# EAGLE design B311D (EAGLE 6.6.0)
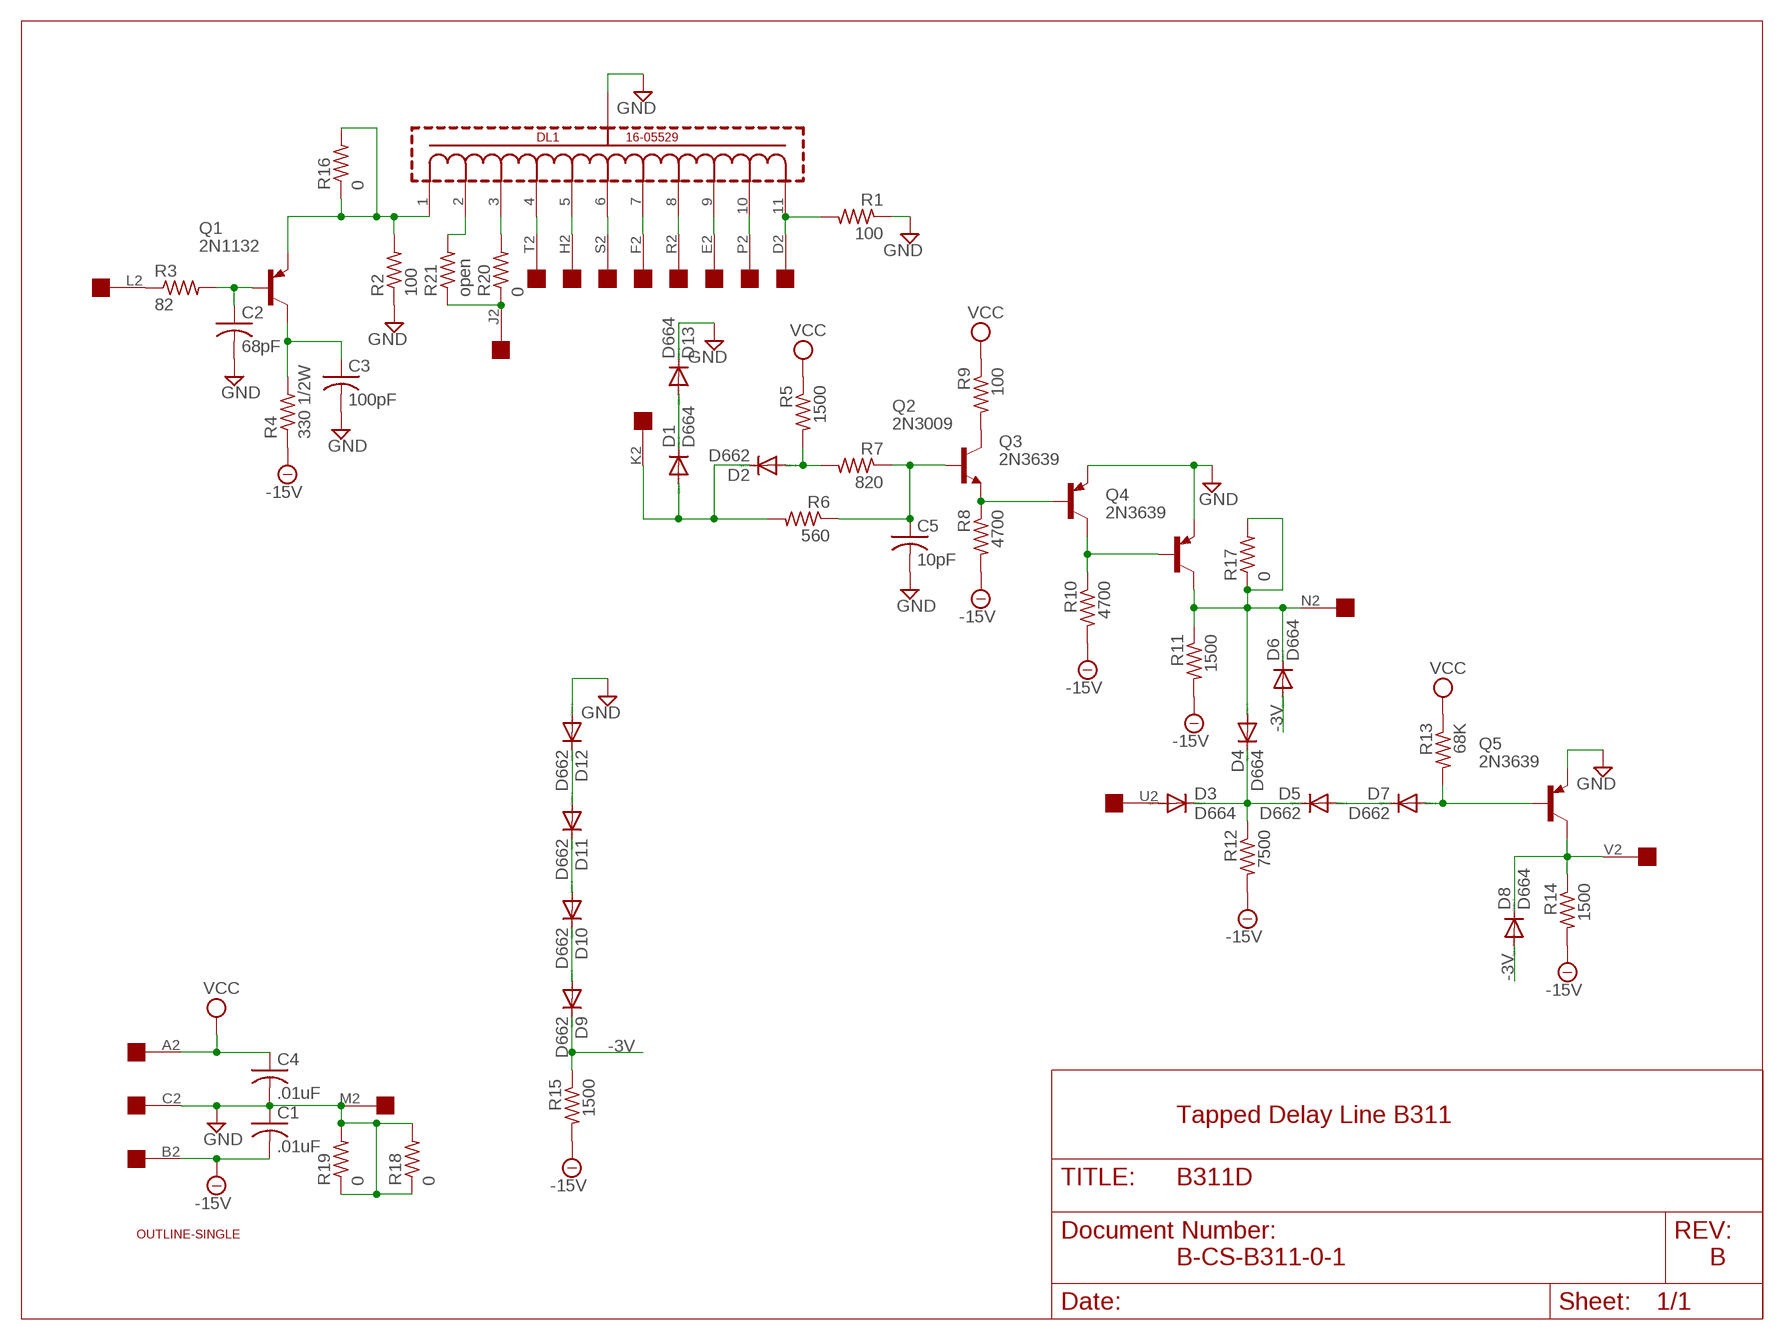
[diagram p0: schematic, sheet 1]

## Parts
C1  .01uF  C-US  [C063-025X075]
C2  68pF  C-US  [C063-025X075]
C3  100pF  C-US  [C063-025X075]
C4  .01uF  C-US  [C063-025X075]
C5  10pF  C-US  [C063-025X075]
D1  D664  DIODE-DO35-10  [DO35-10]
D2  D662  DIODE-DO35-10  [DO35-10]
D3  D664  DIODE-DO35-10  [DO35-10]
D4  D664  DIODE-DO35-10  [DO35-10]
D5  D662  DIODE-DO35-10  [DO35-10]
D6  D664  DIODE-DO35-10  [DO35-10]
D7  D662  DIODE-DO35-10  [DO35-10]
D8  D664  DIODE-DO35-10  [DO35-10]
D9  D662  DIODE-DO35-10  [DO35-10]
D10  D662  DIODE-DO35-10  [DO35-10]
D11  D662  DIODE-DO35-10  [DO35-10]
D12  D662  DIODE-DO35-10  [DO35-10]
D13  D664  DIODE-DO35-10  [DO35-10]
DL1  16-05529  [16-05529]
Q1  2N1132  -PNP-TO5  [TO5]
Q2  2N3009  -NPN-TO5  [TO5]
Q3  2N3639  -PNP-TO5  [TO5]
Q4  2N3639  -PNP-TO5  [TO5]
Q5  2N3639  -PNP-TO5  [TO5]
R1  100  R-US_0207/10  [0207/10]
R2  100  R-US_0207/10  [0207/10]
R3  82  R-US_0207/10  [0207/10]
R4  330 1/2W  R-US_0411/15  [0411/15]
R5  1500  R-US_0207/10  [0207/10]
R6  560  R-US_0207/10  [0207/10]
R7  820  R-US_0207/10  [0207/10]
R8  4700  R-US_0207/10  [0207/10]
R9  100  R-US_0207/10  [0207/10]
R10  4700  R-US_0207/10  [0207/10]
R11  1500  R-US_0207/10  [0207/10]
R12  7500  R-US_0207/10  [0207/10]
R13  68K  R-US_0207/10  [0207/10]
R14  1500  R-US_0207/10  [0207/10]
R15  1500  R-US_0207/10  [0207/10]
R16  0  R-US_0207/10  [0207/10]
R17  0  R-US_0207/10  [0207/10]
R18  0  R-US_0207/10  [0207/10]
R19  0  R-US_0207/10  [0207/10]
R20  0  R-US_0207/10  [0207/10]
R21  open  R-US_0207/10  [0207/10]
U$1  OUTLINE-SINGLE  [SINGLE]
U$2  EDGE-1  [EDGE-CON1]

## Nets
-3V: D6.A D8.A D9.C R15.1
-15V: C1.2 R4.1 R8.2 R10.2 R11.2 R12.2 R14.2 R15.2 U$2.B2
GND: C1.1 C2.2 C3.2 C4.2 C5.2 D12.A D13.C DL1.12(GND) Q3.1(E) Q4.1(E) Q5.1(E) R1.1 R2.1 R18.1 R18.2 R19.1 R19.2 U$2.C2 U$2.M2
N$1: DL1.11 R1.2 U$2.D2
N$2: DL1.10 U$2.P2
N$3: DL1.9 U$2.E2
N$4: DL1.8 U$2.R2
N$5: DL1.3 R20.2
N$6: DL1.4 U$2.T2
N$7: DL1.5 U$2.H2
N$8: DL1.6 U$2.S2
N$9: DL1.7 U$2.F2
N$10: R20.1 R21.1 U$2.J2
N$11: DL1.2 R21.2
N$12: DL1.1 Q1.1(E) R2.2 R16.1 R16.2
N$13: C2.1 Q1.2(B) R3.2
N$14: R3.1 U$2.L2
N$15: C3.1 Q1.3(C) R4.2
N$16: D1.A D2.C R6.2 U$2.K2
N$17: D1.C D13.A
N$18: D2.A R5.2 R7.2
N$19: C5.1 Q2.2(B) R6.1 R7.1
N$20: Q2.3(C) R9.2
N$21: Q2.1(E) Q3.2(B) R8.1
N$22: Q3.3(C) Q4.2(B) R10.1
N$23: D4.A D6.C Q4.3(C) R11.1 R17.1 R17.2 U$2.N2
N$24: D11.A D12.C
N$25: D9.A D10.C
N$26: D10.A D11.C
N$27: D3.A U$2.U2
N$28: D3.C D4.C D5.C R12.1
N$29: D5.A D7.C
N$30: D7.A Q5.2(B) R13.2
N$31: D8.C Q5.3(C) R14.1 U$2.V2
VCC: C4.1 R5.1 R9.1 R13.1 U$2.A2

## Notes on the sheet
- Tapped Delay Line B311
- B-CS-B311-0-1 | B

## Library data of the parts
C1-C5 = dec-con:C-US: Capacitors with funky DEC lead spacing.
D1-D13 = diode:DIODE-: DIODE
DL1 = dec-con:16-05529: Delay Line (M311 style)
Q1 Q3-Q5 = transistor:*-PNP-: PNP Transistror
Q2 = transistor:*-NPN-: NPN Transistror BF959 corrected 2008.03.06
R1-R21 = rcl:R-US_: RESISTOR, American symbol
U$1 = dec-con:OUTLINE-*: Board outlines for DEC boards.
U$2 = dec-con:EDGE-1: Single-Sided DEC Edge Connector -- (side 2)

## Net classes
0 default: width 0.813 mm

## Board
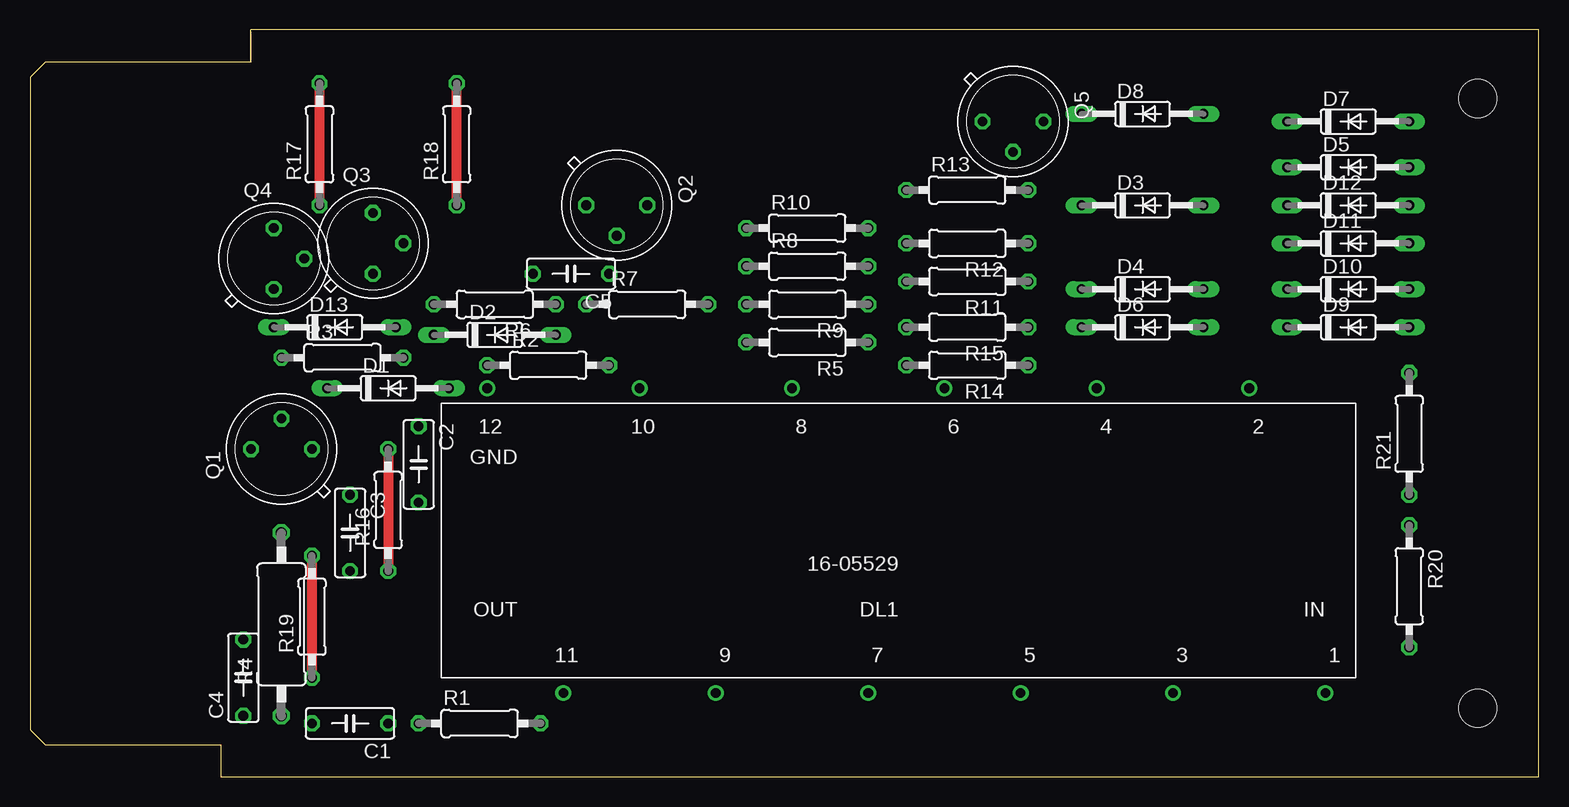
[diagram p1: board, top side]
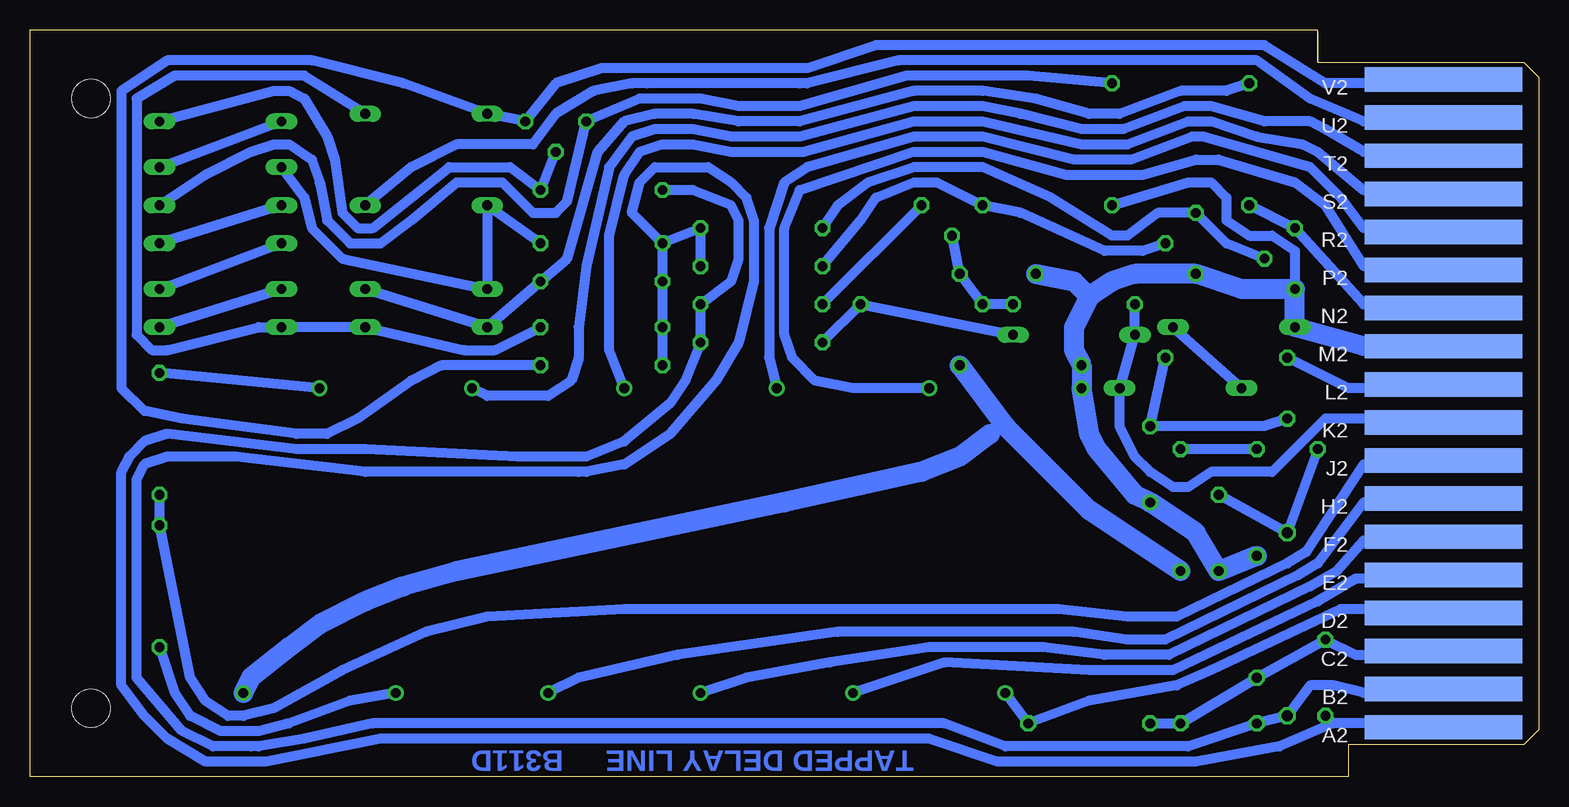
[diagram p2: board, bottom side, seen from below]

Size 125.73 x 62.23 mm. Coordinates in mm from the lower left corner, seen from the top.
Copper layers (1+16): Top 0.035mm / dielectric 1.5mm / Bottom 0.035mm
Design rules "16mils": minimum track width 16mil, minimum drill 32mil, track to track 15mil, track to pad 10mil, pad to pad 10mil, via to via 10mil, smd to smd 10mil, copper to edge 13mil, drill to drill 10mil, minimum pad ring 10mil, minimum via ring 8mil, stop-mask expansion 0mil, vias tented up to drill 0mil, thermal gap 10mil

### Footprints (pad centres in the part's own frame; a part is rotated, then mirrored left to right if it is on the bottom)
C063-025X075 = drill 0.813 octagon: 1 -2.54,0; 2 3.81,0
DO35-10 = drill 0.813 long: A 5.08,0; C -5.08,0
16-05529 = drill 0.813: 1 -35.56,12.7; 2 -29.21,-12.7; 3 -22.86,12.7; 4 -16.51,-12.7; 5 -10.16,12.7; 6 -3.81,-12.7; 7 2.54,12.7; 8 8.89,-12.7; 9 15.24,12.7; 10 21.59,-12.7; 11 27.94,12.7; 12 34.29,-12.7
TO5 = drill 0.813 octagon: 1 0,-2.54; 2 2.54,0; 3 0,2.54
0207/10 = drill 0.813 octagon: 1 -5.08,0; 2 5.08,0
0411/15 = drill 0.914 octagon: 1 -7.62,0; 2 7.62,0
SINGLE = hole 3.175: 120.65,56.515; 120.65,5.715
EDGE-CON1 = smd 13.106 x 2.032 bottom: A2 7.938,4.128; B2 7.938,7.303; C2 7.938,10.477; D2 7.938,13.652; E2 7.938,16.828; F2 7.938,20.003; H2 7.938,23.177; J2 7.938,26.352; K2 7.938,29.527; L2 7.938,32.703; M2 7.938,35.877; N2 7.938,39.053; P2 7.938,42.227; R2 7.938,45.403; S2 7.938,48.578; T2 7.938,51.752; U2 7.938,54.928; V2 7.938,58.102

### Placement (x,y rotation side)
C1  27.31,4.45 180 top
C2  32.39,26.67 270 top
C3  26.67,20.95 270 top
C4  17.78,7.62 90 top
C5  45.72,41.91 180 top
D1  29.85,32.38 0 top
D2  38.74,36.83 0 top
D3  92.71,47.62 0 top
D4  92.71,40.64 0 top
D5  109.86,50.8 0 top
D6  92.71,37.47 0 top
D7  109.86,54.61 0 top
D8  92.71,55.24 0 top
D9  109.86,37.47 0 top
D10  109.86,40.64 0 top
D11  109.86,44.45 0 top
D12  109.86,47.62 0 top
D13  25.4,37.47 0 top
DL1  72.39,19.68 180 top
Q1  20.96,27.3 90 top
Q2  48.9,47.62 270 top
Q3  28.58,44.45 0 top
Q4  20.32,43.18 0 top
Q5  81.92,54.61 270 top
R1  37.47,4.45 0 top
R2  43.18,34.29 0 top
R3  26.04,34.92 0 top
R4  20.96,12.7 90 top
R5  64.77,36.2 180 top
R6  38.74,39.37 180 top
R7  51.44,39.37 0 top
R8  64.77,42.55 0 top
R9  64.77,39.37 180 top
R10  64.77,45.72 0 top
R11  78.11,41.27 180 top
R12  78.11,44.45 180 top
R13  78.11,48.9 0 top
R14  78.11,34.29 180 top
R15  78.11,37.47 180 top
R16  29.85,22.23 90 top
R17  24.13,52.7 90 top
R18  35.56,52.7 90 top
R19  23.5,13.34 90 top
R20  114.94,15.88 270 top
R21  114.94,28.57 90 top
U$1  0,0 0 top
U$2  0,0 0 top

### Tracks (layer width: path | path; a pad name or v marks a point on that pad's centre or on a via)
-3V
  Bottom 0.813: D8.A 102.87,58.42 113.67,58.42 116.84,56.52 116.84,36.83 115.57,35.56 114.3,35.56 106.68,37.47 D9.C D6.A 89.54,35.56 87,35.56 R15.1
-15V
  Bottom 0.813: U$2.B2 8.89,6.99 14.61,6.99 17.15,7.62 19.05,7.62 R4.1 C1.2 29.21,2.54 44.45,2.54 49.53,4.45 97.16,4.45 102.87,3.17 106.68,2.54 107.32,2.54 110.49,2.54 113.03,3.81 116.84,8.26 116.84,24.77 116.21,26.04 114.3,26.67 108.59,26.67 97.79,25.4 80.01,25.4 79.38,25.4 76.2,26.04 72.39,28.57 68.58,33.02 66.68,36.2 65.41,41.27 65.41,46.35 66.04,48.26 67.31,49.53 69.22,50.8 73.66,50.8 74.93,49.53 75.57,46.99 R12.2 | R12.2 R11.2 R15.2 R14.2 | R8.2 R10.2 R12.2
GND
  Top 0.813: R19.2 R19.1 | R18.1 R18.2
  Bottom 0.813: R1.1 C1.1 R19.1 C4.2 15.24,10.16 8.89,10.16 U$2.C2 | U$2.M2 14.61,35.88 | D12.A 111.13,50.16 107.32,52.07 105.41,52.7 104.14,52.7 102.24,51.44 101.6,49.53 100.97,46.35 99.06,44.45 96.52,44.45 93.98,46.35 90.17,49.53 86.36,49.53 83.82,46.99 81.92,46.99 80.96,47.94 Q5.1 74.93,56.52 69.85,56.52 66.68,55.88 61.6,55.88 52.71,58.42 42.55,58.42 R18.2 | R18.1 29.21,49.53 27.31,49.53 26.04,48.26 26.04,46.35 24.13,45.09 22.23,45.09 20.32,43.81 Q4.1
  Bottom 1.676: R19.2 C3.2 28.58,20.32 C2.2 33.66,23.5 36.83,27.3 37.47,28.57 DL1.12 R2.1 38.74,35.56 38.74,37.47 37.47,40.01 | 14.61,35.88 D13.C Q4.1 24.77,40.64 Q3.1 33.66,41.91 35.56,41.27 37.47,40.01 | C5.2 38.74,41.27 37.47,40.01
N$1
  Bottom 0.813: U$2.D2 9.53,13.65 9.53,13.97 16.51,13.97 27.31,8.89 30.16,7.62 37.47,6.35 R1.2 DL1.11
N$2
  Bottom 0.813: DL1.10 57.15,32.38 60.33,33.02 62.23,34.92 62.87,36.83 62.87,45.72 61.6,48.9 52.07,52.07 46.36,52.07 39.37,50.16 33.02,50.16 28.58,51.44 26.67,51.44 20.32,49.53 17.78,47.62 14.61,42.55 8.89,42.55 U$2.P2
N$3
  Bottom 0.813: U$2.E2 8.89,16.51 15.24,16.51 18.42,14.61 30.48,8.89 37.47,8.89 49.53,9.53 DL1.9
N$4
  Bottom 0.813: U$2.R2 8.89,45.72 14.61,45.72 16.51,48.26 19.05,50.8 27.94,53.34 28.89,53.34 33.97,51.44 38.74,51.44 46.36,53.34 52.07,53.34 60.96,50.8 62.87,49.53 64.14,45.72 64.14,34.92 DL1.8
N$5
  Bottom 0.813: DL1.3 99.06,6.35 104.14,4.45 106.68,3.81 109.86,3.81 112.4,5.08 113.67,6.99 R20.2
N$6
  Bottom 0.813: U$2.T2 8.89,52.07 14.61,52.07 17.78,53.98 19.05,54.61 22.86,54.61 27.31,55.88 29.53,55.88 34.61,53.98 38.1,53.98 43.18,55.24 46.36,55.88 52.07,55.88 61.6,53.34 67.31,53.34 70.49,53.98 73.66,53.98 75.57,53.34 77.47,50.8 79.38,42.55 80.01,37.47 80.01,34.92 80.65,33.02 82.55,31.75 87.63,31.75 DL1.4
N$7
  Bottom 0.813: U$2.H2 8.89,22.86 14.61,22.86 18.42,17.78 20,16.83 31.12,11.43 34.29,11.43 38.74,12.06 58.42,12.06 71.76,10.16 80.01,8.26 DL1.5
N$8
  Bottom 0.813: DL1.6 77.47,35.56 77.47,45.09 76.2,50.16 74.93,52.07 73.03,52.7 70.49,52.7 67.31,52.07 61.28,52.07 52.07,54.61 46.36,54.61 38.1,52.7 34.29,52.7 29.21,54.61 27.31,54.61 23.5,53.34 19.69,52.7 18.42,52.07 14.61,48.9 8.89,48.9 U$2.S2
N$9
  Bottom 0.813: U$2.F2 10.16,19.68 14.61,19.68 16.83,17.14 19.05,15.88 30.8,10.16 36.2,10.16 41.28,10.79 50.8,10.79 59.06,9.53 66.04,8.26 DL1.7
N$10
  Bottom 0.813: U$2.J2 8.26,26.04 14.61,26.04 19.37,18.73 20.96,17.78 30.16,13.34 34.29,13.34 40.01,13.97 76.2,13.97 87.63,13.34 92.71,12.06 99.7,8.89 105.41,5.71 107.95,5.08 109.22,5.08 111.13,6.35 112.4,8.26 R20.1 R21.1
N$11
  Bottom 0.813: DL1.2 R21.2
N$12
  Top 0.813: R16.2 R16.1
  Bottom 0.813: Q1.1 R16.2 | 44.45,29.21 45.72,28.57
  Bottom 1.676: R16.1 37.47,22.23 44.45,29.21 R2.2 | 45.72,28.57 48.26,26.67 51.44,25.4 62.87,22.86 78.11,19.68 90.17,17.14 94.62,15.88 97.79,14.61 101.6,12.7 104.14,10.79 107.32,8.26 DL1.1
N$13
  Bottom 0.813: Q1.2 22.86,29.21 C2.1 R3.2
N$14
  Bottom 0.813: U$2.L2 8.89,32.38 15.88,32.38 R3.1
N$15
  Bottom 0.813: Q1.3 R4.2 C3.1
N$16
  Bottom 0.813: U$2.K2 8.26,29.84 17.78,29.84 22.23,25.4 27.31,25.4 29.21,24.13 30.48,24.13 32.39,25.4 33.66,26.67 34.93,29.21 D1.A D2.C R6.2
N$17
  Bottom 0.813: D1.C D13.A
N$18
  Bottom 0.813: R5.2 R7.2 D2.A
N$19
  Bottom 0.813: Q2.2 C5.1 R7.1 R6.1
N$20
  Bottom 0.813: Q2.3 R9.2
N$21
  Bottom 0.813: Q3.2 33.02,43.81 36.2,43.81 43.18,46.99 Q2.1 50.17,49.53 52.07,49.53 55.25,48.26 56.52,46.35 R8.1
N$22
  Bottom 0.813: Q4.2 26.04,44.45 Q3.3 31.75,46.99 34.29,45.09 35.56,45.09 40.64,48.26 46.36,50.8 52.07,50.8 55.88,49.53 58.42,47.62 R10.1
N$23
  Top 0.813: R17.1 R17.2
  Bottom 0.813: U$2.N2 8.89,39.37 14.61,39.37 Q4.3 R17.1 | R17.2 26.04,57.15 29.85,57.15 34.93,55.24 37.47,55.24 41.91,56.52 46.36,57.15 52.07,57.15 61.6,54.61 66.68,54.61 70.49,55.24 73.66,55.24 76.2,54.61 78.42,52.07 80.96,43.18 R11.1 D6.C D4.A
N$24
  Bottom 0.813: D12.C D11.A
N$25
  Bottom 0.813: D10.C D9.A
N$26
  Bottom 0.813: D10.A D11.C
N$27
  Bottom 0.813: U$2.U2 8.89,54.61 14.61,54.61 19.05,56.52 23.5,59.69 53.34,59.69 60.96,57.78 61.6,57.78 74.3,57.78 75.57,57.78 78.74,57.15 81.92,55.24 83.82,52.7 90.17,52.7 93.98,50.8 D3.A
N$28
  Bottom 0.813: R12.1 D3.C D4.C 99.7,43.18 102.24,45.72 102.87,48.26 D5.C
N$29
  Bottom 0.813: D5.A D7.C
N$30
  Bottom 0.813: D7.A 105.41,57.15 104.14,57.15 102.87,56.52 100.97,53.34 100.33,51.44 99.7,46.99 98.43,45.72 97.16,45.72 90.81,50.8 85.73,50.8 R13.2 Q5.2
N$31
  Bottom 0.813: U$2.V2 9.53,57.78 17.78,57.78 22.86,60.96 55.25,60.96 60.96,59.05 78.11,59.05 81.92,57.78 Q5.3 D8.C 94.62,57.78 102.24,59.69 114.3,59.69 118.11,57.15 118.11,32.38 116.21,30.48 113.03,29.84 103.51,28.57 100.97,28.57 98.43,29.84 93.98,33.02 91.44,34.29 R14.1
VCC
  Bottom 0.813: U$2.A2 9.53,4.45 17.15,4.45 | 17.15,4.45 C4.1 | 17.15,4.45 21.59,2.54 28.58,1.27 45.09,1.27 50.8,3.17 96.52,3.17 106.05,1.27 111.13,1.27 114.3,3.17 116.21,5.08 118.11,7.62 118.11,25.4 117.48,26.67 116.21,27.94 114.3,28.57 103.51,27.3 97.79,27.3 85.09,26.67 79.38,26.67 76.2,27.94 72.39,31.11 71.12,33.02 R5.1 R9.1 67.31,41.27 66.68,43.18 66.68,46.35 67.31,47.62 70.49,48.9 R13.1

### Text on the board
Bottom: TAPPED DELAY LINE | B311D